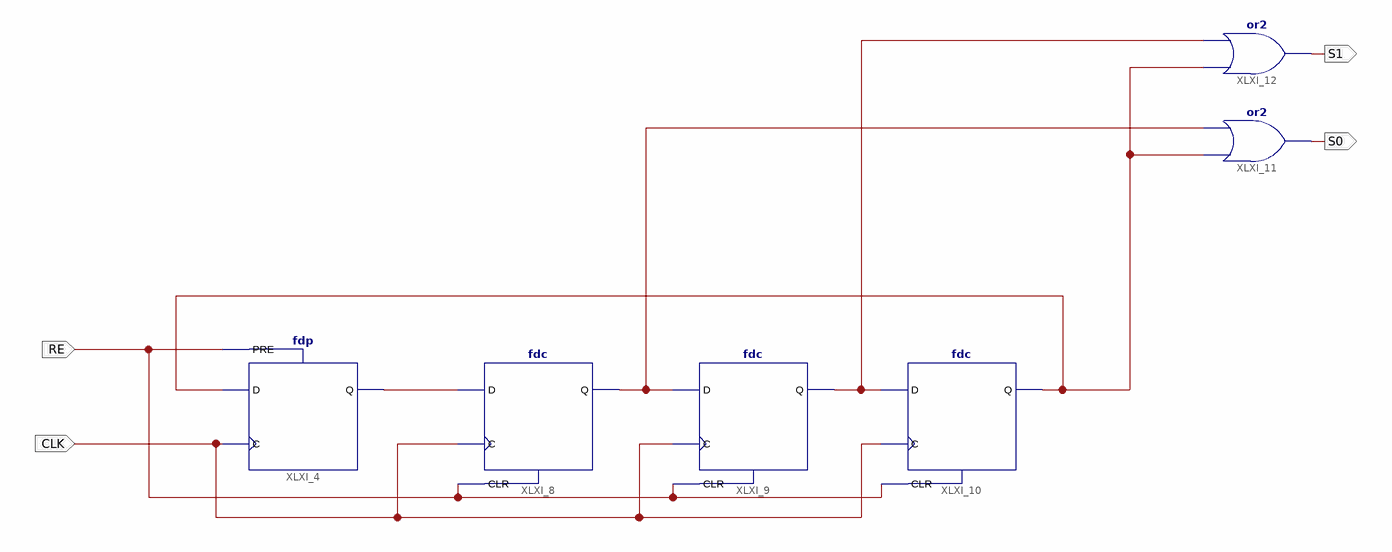
[diagram p0: schematic sheet 1]
// Xilinx ISE schematic SELECTOR.sch (spartan6) as structural Verilog: 6 symbols, 4 ports
module SELECTOR (
  input  CLK,
  input  RE,
  output S0,
  output S1
);

  wire XLXN_10, XLXN_19, XLXN_22, XLXN_23;

  fdp XLXI_4 (.C(CLK), .D(XLXN_23), .PRE(RE), .Q(XLXN_10));
  fdc XLXI_8 (.C(CLK), .CLR(RE), .D(XLXN_10), .Q(XLXN_19));
  fdc XLXI_9 (.C(CLK), .CLR(RE), .D(XLXN_19), .Q(XLXN_22));
  fdc XLXI_10 (.C(CLK), .CLR(RE), .D(XLXN_22), .Q(XLXN_23));
  or XLXI_11 (S0, XLXN_23, XLXN_19);
  or XLXI_12 (S1, XLXN_23, XLXN_22);
endmodule
